# EasyEDA Pro project jlcProject.epro, board PCB2
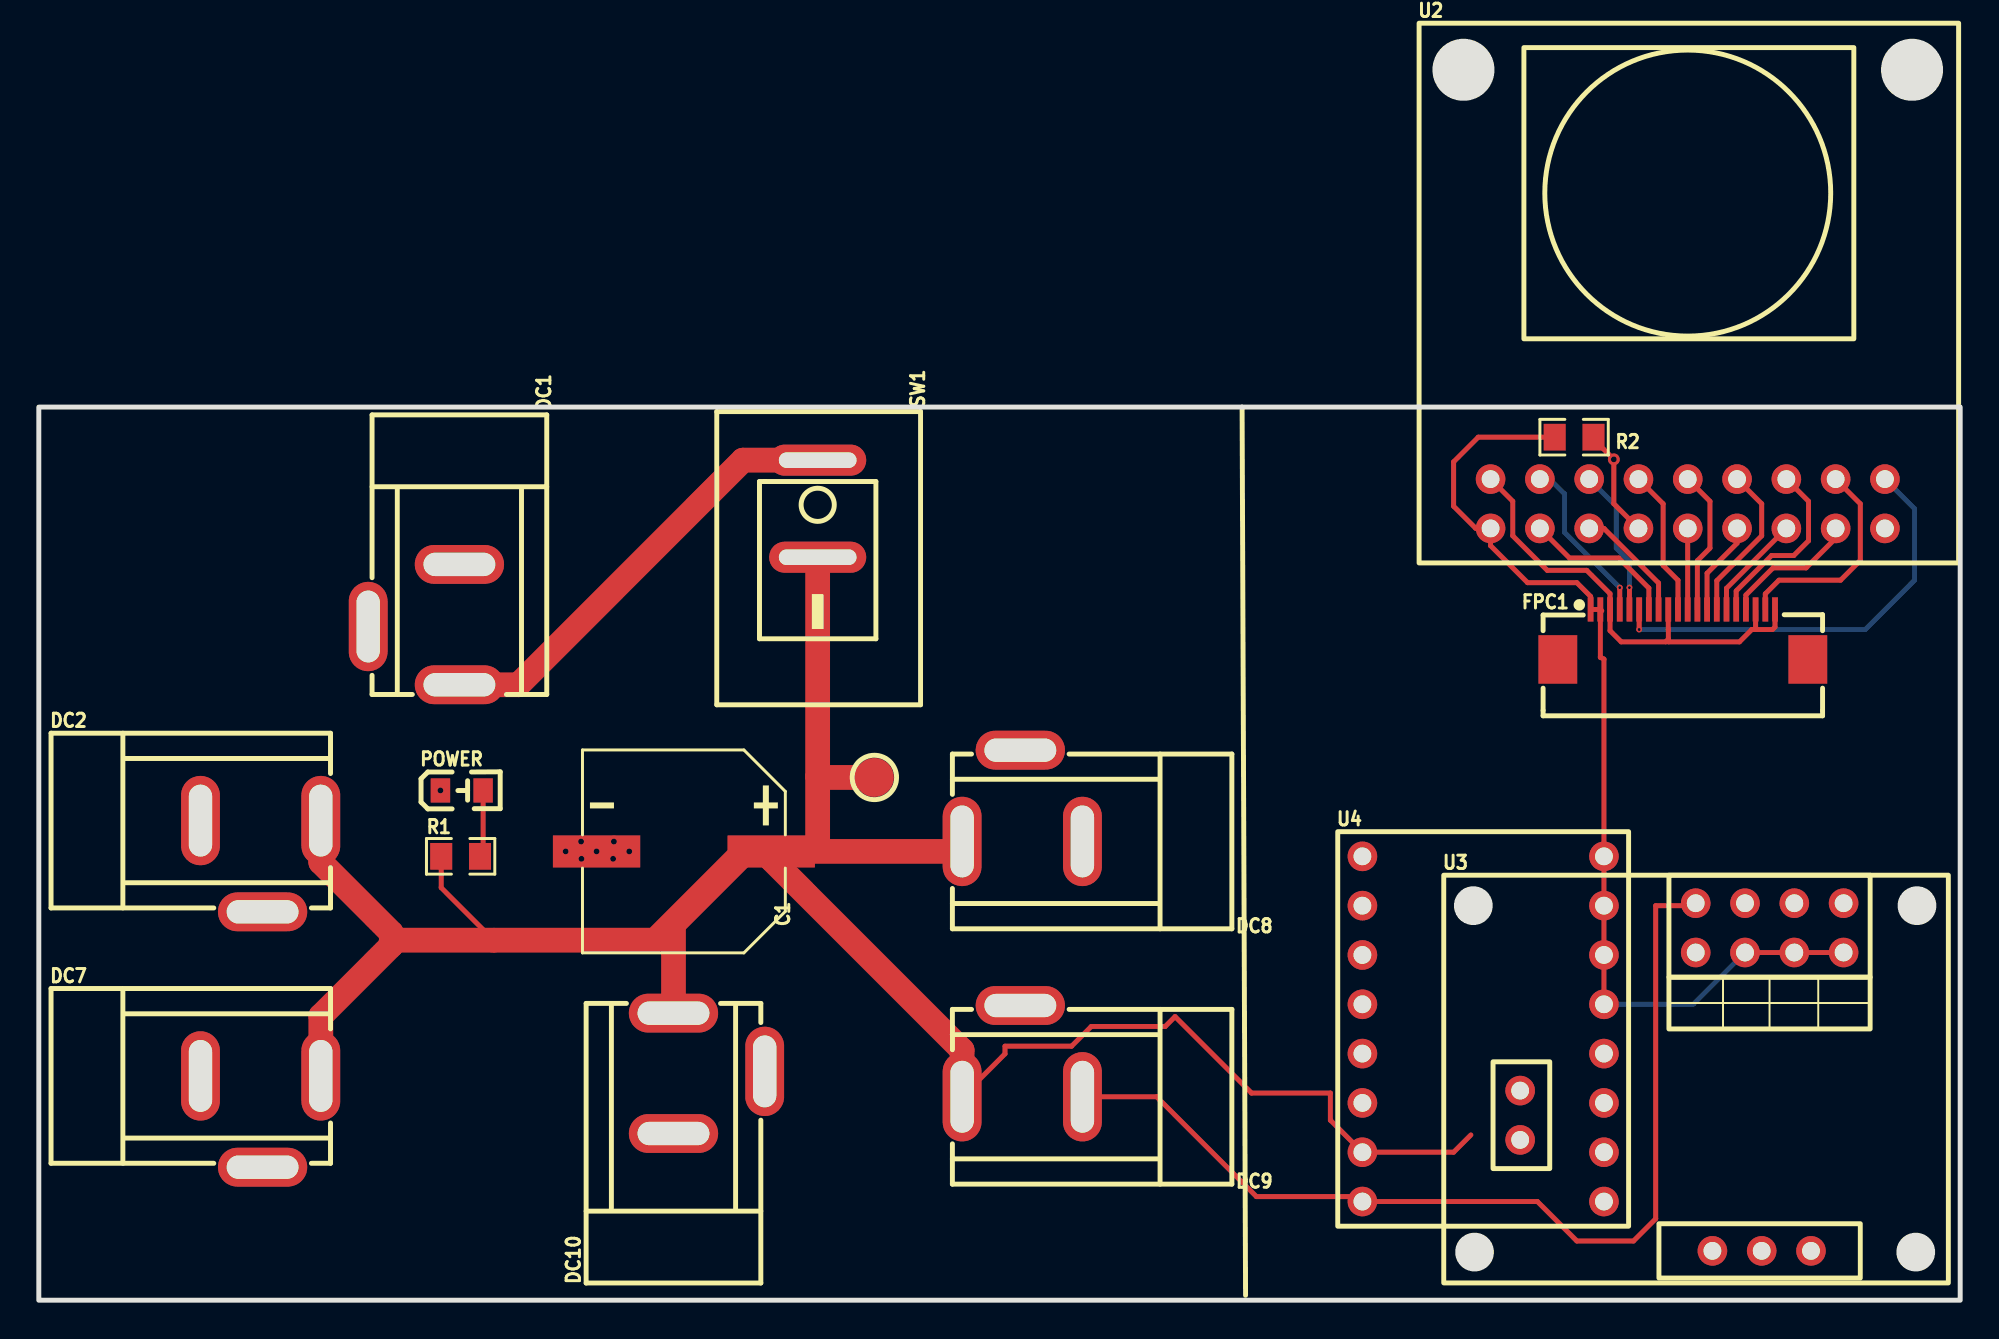
[diagram p7: board, top side]
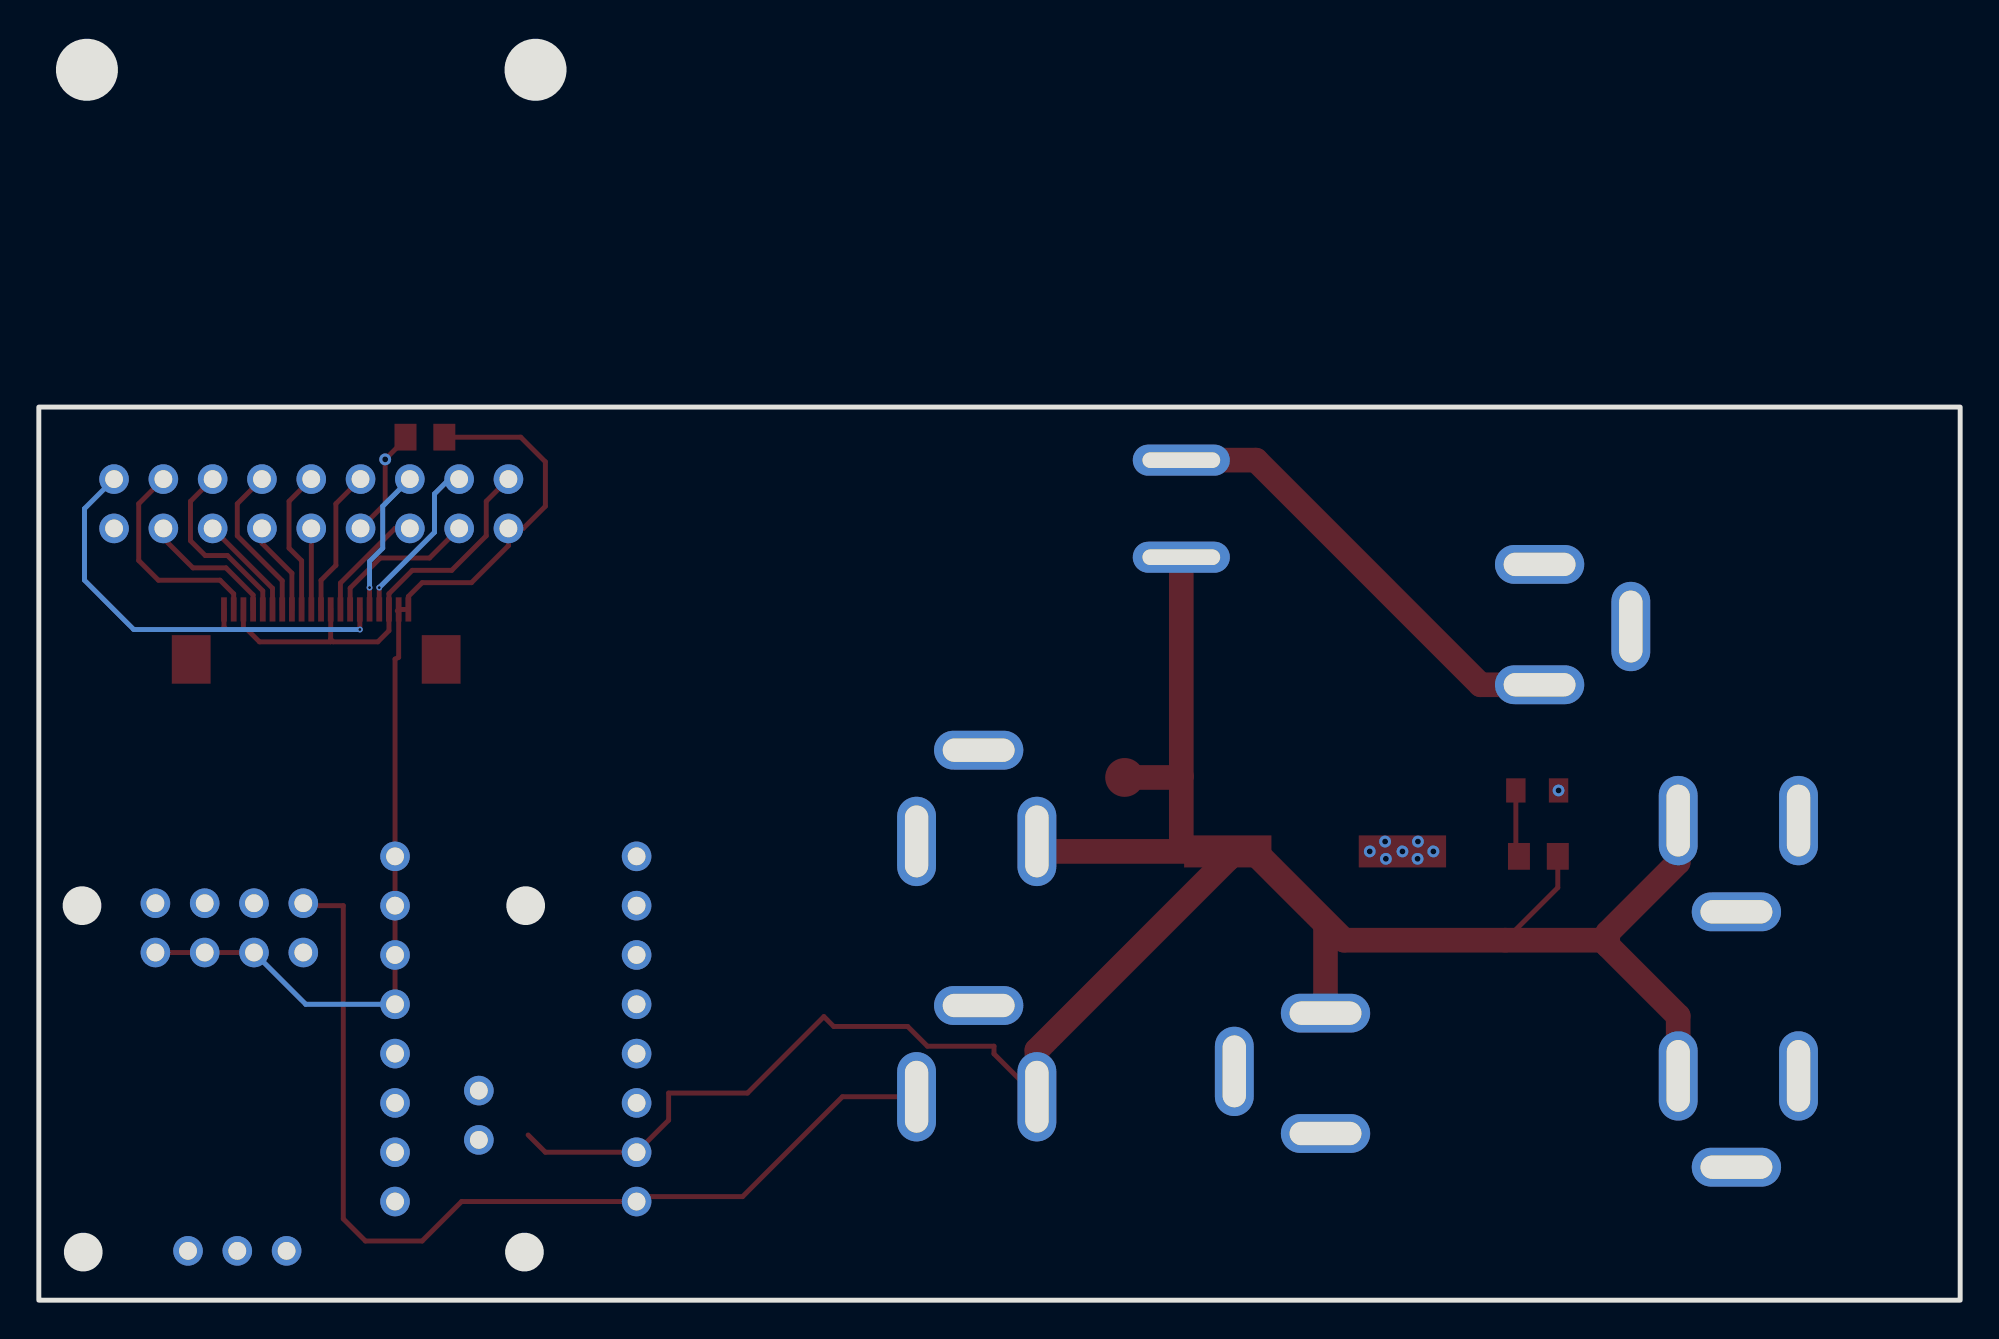
[diagram p8: board, bottom side, seen from below]

Outline 99 x 64.97 mm; copper layers: Top Layer, Bottom Layer. Coordinates in mm from the lower left corner of the outline.
Outline path: rectangle 0,46 99,0
Stack: Top Layer 0.035mm / Dielectric1 1.51mm FR4 er 4.5 / Bottom Layer 0.035mm

## Design rules (mm)
template: 自定义配置
spacing copperThickness1oz (default): track to track 0.102, other pairs 0.152 to 0.3
spacing copperThickness2oz: track to track 0.203, other pairs 0.152 to 0.3
track width copperThickness1oz (default): min 0.127, default 0.254, max 2.54
track width copperThickness2oz: min 0.203, default 0.254, max 2.54
differential pair differentialPair (default): width min 0.127, default 0.254, max 2.54; gap min 0.152, default 0.152
via viaSize (default): diameter min 0.5, default 0.61, max 10; hole min 0.3, default 0.305, max 6.299
via viaSize1: diameter min 0.254, default 0.305, max 10; hole min 0.102, default 0.152, max 6.299
net SCCB_SCL uses viaSize1
net SCCB_SDA uses viaSize1
net PWDN uses viaSize1
net D0 uses viaSize1
net D1 uses viaSize1
net D2 uses viaSize1
net D3 uses viaSize1
net D4 uses viaSize1
net D5 uses viaSize1
net D6 uses viaSize1
net D7 uses viaSize1

## Placement (name value [footprint] x y rotation side)
C1  470uf  [CAP-SMD_BD10.0-L10.3-W10.3-FD]  33.24 23.11 180 top
DC1  电源输入  [DC-IN-TH_DC005]  19.32 34.8 270 top
DC2  步进电机模块电源输出1  [DC-IN-TH_DC005]  11.43 22.35 0 top
DC7  步进电机模块电源输出2  [DC-IN-TH_DC005]  11.43 9.2 0 top
DC8  步进电机模块电源输出3  [DC-IN-TH_DC005]  50.67 25.98 180 top
DC9  步进电机模块电源输出4  [DC-IN-TH_DC005]  50.67 12.83 180 top
DC10  主控模块电源输出  [DC-IN-TH_DC005]  35.05 11.68 90 top
FPC1  FPC-05F-20PH20  [FPC-SMD_20P-P0.50_XUNPU_FPC-05F-20PH20]  84.71 34.29 0 top
POWER  -  [LED_0805]  21.84 26.25 0 top
R1  2K  [R0805]  21.73 22.86 0 top
R2  10K  [R0805]  79.11 44.45 180 top
SW1  KEY  [SW-TH_2P-L15.0-W10.5-P5.00_KCD11-2P-R]  40.13 40.77 270 top
U1  -  [测试点]  43.05 26.92 0 top
U2  -  [OV2640模块]  71.12 37.97 0 top
U3  -  [FOCMini]  72.39 0.89 0 top
U4  -  [DRV8825驱动模块]  66.8 3.81 0 top

## Footprints (pads in the part's own frame, mm; a bottom-side part is the same pattern mirrored in y, then rotated)
CAP-SMD_BD10.0-L10.3-W10.3-FD
  rect 4.5x1.65 smd: 1(-4.5,0) 2(4.5,0)
DC-IN-TH_DC005
  oval 2x4.6 hole 1.2x3.7: 1(3.1,2.35) 2(-3.1,2.35)
  oval 4.6x2 hole 3.7x1.2: 3(0.1,-2.35)
DRV8825驱动模块
  round 1.524 hole 0.914: 1(1.397,19.05) 2(1.397,16.51) 3(1.397,13.97) 4(1.397,11.43) 5(1.397,8.89) 6(1.397,6.35) 7(1.397,3.81) 8(1.397,1.27) 9(13.843,1.27) 10(13.843,3.81) 11(13.843,6.35) 12(13.843,8.89) 13(13.843,11.43) 14(13.843,13.97) 15(13.843,16.51) 16(13.843,19.05)
FOCMini
  round 1.524 hole 0.914: 1(12.983,19.558) 2(15.523,19.558) 3(18.063,19.558) 4(20.603,19.558) 5(12.983,17.018) 6(15.523,17.018) 7(18.063,17.018) 8(20.603,17.018) 9(13.843,1.651) 10(16.383,1.651) 11(18.923,1.651) 12(3.937,9.906) 13(3.937,7.366)
FPC-SMD_20P-P0.50_XUNPU_FPC-05F-20PH20
  rect 0.3x1.25 smd: 1(-4.75,1.288) 2(-4.25,1.288) 3(-3.75,1.288) 4(-3.25,1.288) 5(-2.75,1.288) 6(-2.25,1.288) 7(-1.75,1.288) 8(-1.25,1.288) 9(-0.75,1.288) 10(-0.25,1.288) 11(0.25,1.288) 12(0.75,1.288) 13(1.25,1.288) 14(1.75,1.288) 15(2.25,1.288) 16(2.75,1.288) 17(3.25,1.288) 18(3.75,1.288) 19(4.25,1.288) 20(4.75,1.288)
  rect 2x2.5 smd: 21(6.44,-1.288) 22(-6.44,-1.288)
LED_0805
  rect 1x1.25 smd: 1(-1.15,0.005) 2(1.05,0.005)
OV2640模块
  round 1.524 hole 0.914: 1(3.683,1.778) 2(6.223,1.778) 3(8.763,1.778) 4(11.303,1.778) 5(13.843,1.778) 6(16.383,1.778) 7(18.923,1.778) 8(21.463,1.778) 9(24.003,1.778) 10(3.683,4.318) 11(6.223,4.318) 12(8.763,4.318) 13(11.303,4.318) 14(13.843,4.318) 15(16.383,4.318) 16(18.923,4.318) 17(21.463,4.318) 18(24.003,4.318)
R0805
  rect 1.133x1.377 smd: 1(-1,0) 2(1,0)
SW-TH_2P-L15.0-W10.5-P5.00_KCD11-2P-R
  oval 1.6x5 hole 0.8x4: 1(-2.5,0) 2(2.5,0)
测试点
  round 2 smd: 1(0,0)

## Nets
As in the schematic.

Pads without a net: FPC1 21 22; U2 9; U3 2 3 4 5 9 10 11 12; U4 1 2 3 4 5 6 9 10 11 12

## Via types
v1: diameter 0.61, hole 0.305, Top Layer to Bottom Layer, 9 vias
v2: diameter 0.305, hole 0.152, Top Layer to Bottom Layer, 3 vias

## Routing (per net, layer and track width the routed paths; a pad name or vN(x,y) marks a point on that pad's centre or on a via; arc(x,y) is an arc through that point)
3.3V: length 52.7
  Top Layer w0.254: FPC1.2 80.46,33.11 80.65,33.02 U4.16 U4.15 U4.14 U4.13 ; FPC1.2 FPC1.1 79.96,36.25 79.25,36.96 76.71,36.96 74.8,38.86 U2.1 74.04,39.75 72.9,40.89 72.9,43.18 74.17,44.45 R2.2 ; FPC1.2 80.53,35.51 ; U3.8 U3.7 U3.6
  Bottom Layer w0.254: U3.6 85.25,15.24 U4.13
12V: length 130.3
  Top Layer w0.254: R1.1 20.73,21.25 23.44,18.54 ; DC9.1 49.78,12.69 49.78,13.08 53.21,13.08 54.23,14.1 58.04,14.1 58.55,14.61 62.48,10.67 66.55,10.67 66.55,9.27 68.2,7.62 72.9,7.62 73.79,8.51
  Top Layer w1.27: U1.1 40.19,26.92 40.13,26.99 ; DC9.1 47.57,12.88 37.74,22.71 C1.1 ; 36.45,23.11 C1.1 ; 36.45,23.11 36.32,23.11 31.75,18.54 18.16,18.54 ; 36.45,23.11 32.7,19.37 DC10.1 ; C1.1 39.6,23.11 ; DC8.1 47.06,23.11 39.6,23.11 ; 40.13,26.99 SW1.2 ; 40.13,26.99 40.13,23.65 39.6,23.11 ; 18.16,18.54 18.16,18.92 14.53,22.55 DC2.1 ; 18.16,18.54 18.16,18.27 14.53,14.64 DC7.1
AGND: length 51.3
  Top Layer w0.254: U3.1 85.25,20.32 83.31,20.32 83.31,4.19 82.17,3.05 79.25,3.05 77.22,5.08 68.2,5.08 67.94,5.33 62.74,5.33 57.59,10.48 DC9.2
  vias: v1(20.69,26.25) v1(27.14,23.11) v1(27.94,23.62) v1(27.96,22.73) v1(28.74,23.11) v1(29.63,23.62) v1(29.59,22.73) v1(30.42,23.11)
GND: length 24.3
  Top Layer w0.254: 83.96,34.04 83.96,33.91 87.63,33.91 88.26,34.54 88.54,34.54 ; 83.96,34.04 83.83,33.91 81.53,33.91 80.96,34.48 FPC1.3 80.96,36.39 79.76,37.59 77.72,37.59 75.95,39.37 75.95,41.15 U2.10 ; 83.96,34.04 83.96,34.54 83.96,34.55 FPC1.9 ; 88.54,34.54 88.46,34.62 FPC1.18 ; 88.54,34.54 89.33,34.54 89.46,34.67 FPC1.20
D0: length 7.6
  Top Layer w0.254: U2.13 83.69,41.02 83.69,37.85 84.46,37.08 FPC1.10
D1: length 4.2
  Top Layer w0.254: U2.5 84.96,39.75 FPC1.11
D2: length 7.5
  Top Layer w0.254: U2.14 86.11,41.15 86.11,38.73 85.46,38.09 FPC1.12
D3: length 4.8
  Top Layer w0.254: FPC1.13 85.96,37.44 87.5,38.99 U2.6
D4: length 8.2
  Top Layer w0.254: FPC1.14 86.46,37.06 88.77,39.37 88.77,41.02 U2.15
D5: length 5.5
  Top Layer w0.254: FPC1.15 86.96,36.67 U2.7
D6: length 9.4
  Top Layer w0.254: U2.16 91.19,41.15 91.19,39.12 90.42,38.35 89.28,38.35 87.46,36.53 FPC1.16
D7: length 7.1
  Top Layer w0.254: FPC1.17 87.96,36.32 89.36,37.72 91.06,37.72 92.58,39.24 U2.8
HSYNC: length 6.1
  Top Layer w0.254: FPC1.8 83.46,36.94 80.65,39.75 U2.3
PCLK: length 11.1
  Top Layer w0.254: FPC1.19 88.96,36.38 89.66,37.08 92.84,37.08 93.85,38.1 93.85,41.02 U2.17
PWDN: length 22.1
  Top Layer w0.254: FPC1.6 v2(82.46,34.54)
  Bottom Layer w0.254: v2(82.46,34.54) 94.11,34.54 96.65,37.08 96.65,40.77 U2.18
SCCB_SCL: length 8.7
  Top Layer w0.254: FPC1.4 v2(81.46,36.7)
  Bottom Layer w0.254: v2(81.46,36.7) 78.61,39.55 78.61,41.53 77.85,42.29 U2.11
SCCB_SDA: length 7.6
  Top Layer w0.254: FPC1.5 v2(81.96,36.7)
  Bottom Layer w0.254: v2(81.96,36.7) 81.96,38.06 81.28,38.73 81.28,40.89 U2.12
VSYNC: length 8
  Top Layer w0.254: U2.2 78.87,38.23 81.41,38.23 82.96,36.67 FPC1.7
$1N1176: length 23.3
  Top Layer w1.27: SW1.1 36.28,43.27 24.71,31.7 21.67,31.7
$1N1455: length 3.5
  Top Layer w0.254: R1.2 22.89,23.02 POWER.2
$1N2369: length 5.7
  Top Layer w0.254: R2.1 80.11,44.35 v1(81.15,43.31) 81.15,41.02 U2.4

## Copper pours and planes (outline as drawn; the poured copper is in the pictures)
AGND on Bottom Layer: -2.67,48.01 60.58,48.01 60.58,-1.52 -2.67,-1.52
(no net) on Bottom Layer: 0,46 5.59,46 5.59,40.26 0,40.26
(no net) on Bottom Layer: 56.21,5.87 61.79,5.87 61.79,0.13 56.21,0.13
(no net) on Bottom Layer: 0.21,5.87 5.79,5.87 5.79,0.13 0.21,0.13
(no net) on Bottom Layer: 56.21,45.87 61.79,45.87 61.79,40.13 56.21,40.13
